# Altium schematic sheet Quad-Stage-Prototype_V1.0.SchDoc: Quad Stage Prototype
size A4; PageSetup: Record=PageOptions|CenterHorizontal=True|CenterVertical=True|PrintScale=0.97|XCorrection=1.00|YCorrection=1.00|PrintKind=0|BorderSize=5000000|LeftOffset=0|BottomOffset=0|Orientation=2|PaperLength=1000|PaperWidth=1000|Scale=100|PaperSource=7|PrintQuality=-3|MediaType=1|DitherType=10|PrintScaleMode=1|PaperKind=A4|PaperIndex=9; Organization: Ostschweizer Fachhochschule; Address2: Florian Baumgartner & Thierry Schwaller; Address3: florian.baumgartner@ost.ch; DocumentNumber: 1; Revision: V1.0; SheetNumber: 1; SheetTotal: 5; Author: Florian Baumgartner & Thierry Schwaller; Subtitle: Overview
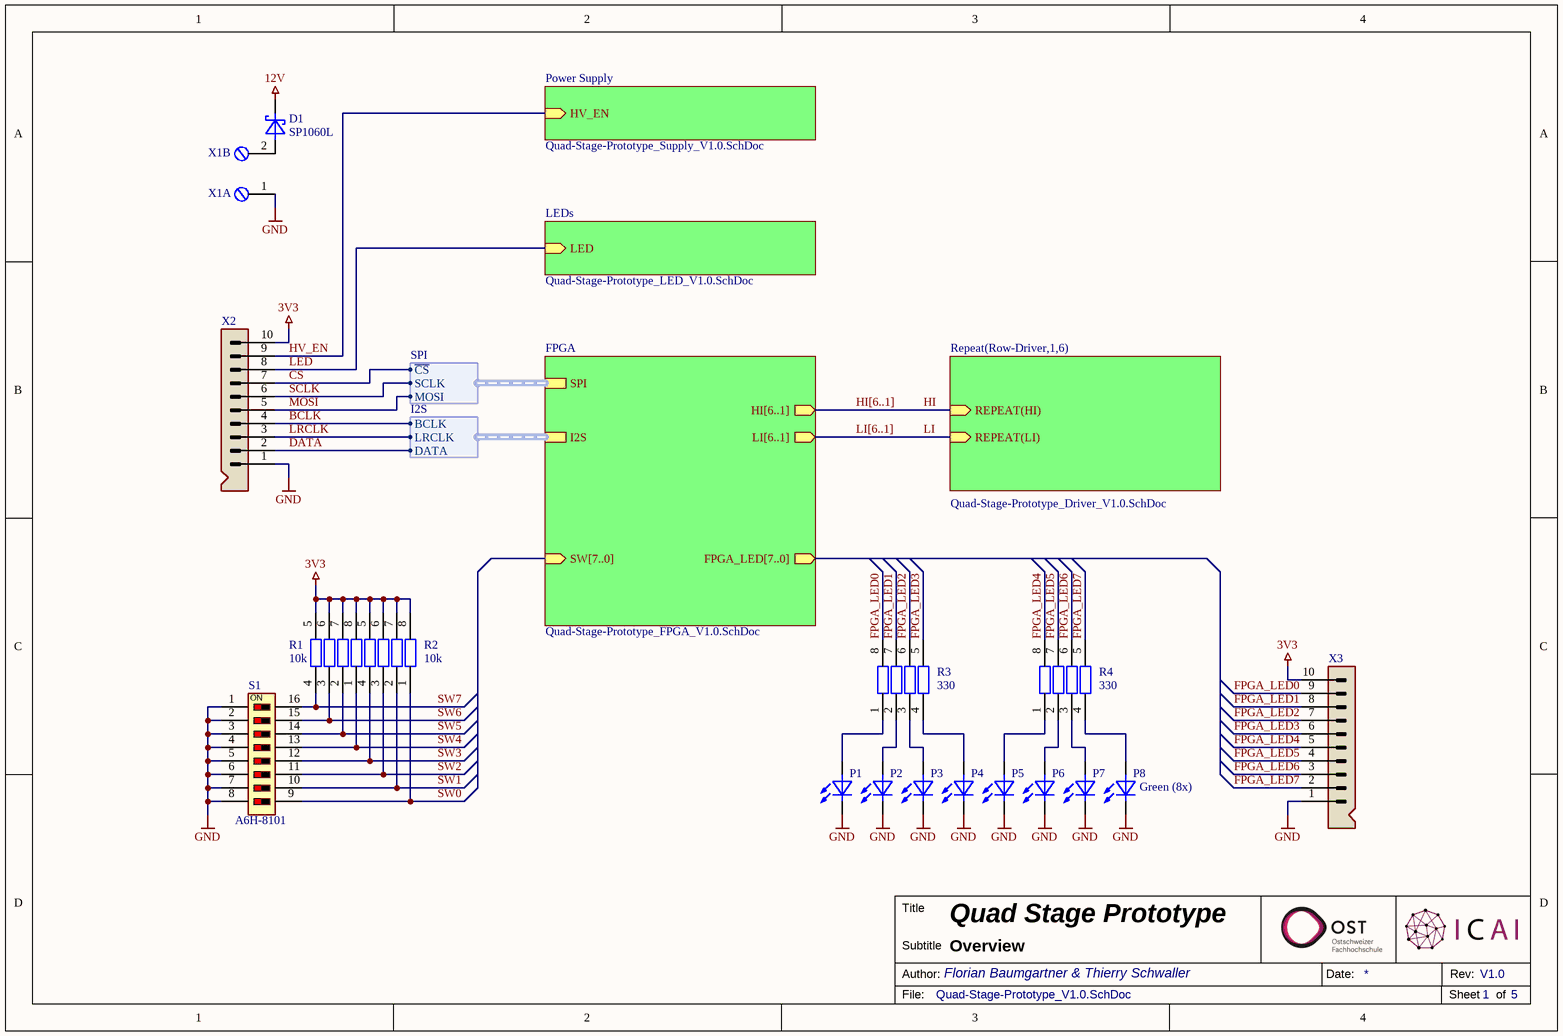
[diagram p0: Quad-Stage-Prototype_V1.0.SchDoc]

## Parts
D1  SP1060L  [SMD Diode TO-277]
P1  Green  [SMD LED 0603]  (value not drawn)
P2  Green  [SMD LED 0603]  (value not drawn)
P3  Green  [SMD LED 0603]  (value not drawn)
P4  Green  [SMD LED 0603]  (value not drawn)
P5  Green  [SMD LED 0603]  (value not drawn)
P6  Green  [SMD LED 0603]  (value not drawn)
P7  Green  [SMD LED 0603]  (value not drawn)
P8  Green  [SMD LED 0603]  (value not drawn)
R1  10k  [SMD Widerstand Array 4-Fach 0603]
R2  10k  [SMD Widerstand Array 4-Fach 0603]
R3  330  [SMD Widerstand Array 4-Fach 0603]
R4  330  [SMD Widerstand Array 4-Fach 0603]
S1  A6H-8101  [SMD DIP-Switch 8-Pos]
X1  X-Klemme (2-Pol)  [THT Schraubklemme 2-Pol (WJ500V-5.08-2P)]  (value not drawn)  (parts A,B of 2)
X2  Stiftleiste (10-Fach)  [THT Pin-Header 10x1 (90°)]  (value not drawn)
X3  Stiftleiste (10-Fach)  [THT Pin-Header 10x1 (90°)]  (value not drawn)

## Sub-sheets
FPGA = Quad-Stage-Prototype_FPGA_V1.0.SchDoc: LI[6..1] (out), HI[6..1] (out), I2S (harness I2S), SPI (harness SPI), FPGA_LED[7..0] (out), SW[7..0] (in)
LEDs = Quad-Stage-Prototype_LED_V1.0.SchDoc: LED (in)
Power Supply = Quad-Stage-Prototype_Supply_V1.0.SchDoc: HV_EN (in)
Repeat(Row-Driver,1,6) = Quad-Stage-Prototype_Driver_V1.0.SchDoc: REPEAT(HI) (in), REPEAT(LI) (in)

## Harnesses
SPI: SCLK, MOSI, ~{CS}
I2S: BCLK, LRCLK, DATA

## Nets
3V3: R1.5 R1.6 R1.7 R1.8 R2.5 R2.6 R2.7 R2.8 X2.10 X3.10
12V: D1.K
GND: P1.K P2.K P3.K P4.K P5.K P6.K P7.K P8.K S1.1 S1.2 S1.3 S1.4 S1.5 S1.6 S1.7 S1.8 X1.1 X2.1 X3.1
BCLK: X2.4 ; sheet FPGA/I2S.BCLK
~{CS}: X2.7 ; sheet FPGA/SPI.~{CS}
DATA: X2.2 ; sheet FPGA/I2S.DATA
FPGA_LED0: R3.8 X3.9
FPGA_LED1: R3.7 X3.8
FPGA_LED2: R3.6 X3.7
FPGA_LED3: R3.5 X3.6
FPGA_LED4: R4.8 X3.5
FPGA_LED5: R4.7 X3.4
FPGA_LED6: R4.6 X3.3
FPGA_LED7: R4.5 X3.2
HI: sheet Repeat(Row-Driver,1,6)/REPEAT(HI)
HV_EN: X2.9 ; sheet Power Supply/HV_EN
LED: X2.8 ; sheet LEDs/LED
LI: sheet Repeat(Row-Driver,1,6)/REPEAT(LI)
LRCLK: X2.3 ; sheet FPGA/I2S.LRCLK
MOSI: X2.5 ; sheet FPGA/SPI.MOSI
SCLK: X2.6 ; sheet FPGA/SPI.SCLK
SW0: R2.1 S1.9
SW1: R2.2 S1.10
SW2: R2.3 S1.11
SW3: R2.4 S1.12
SW4: R1.1 S1.13
SW5: R1.2 S1.14
SW6: R1.3 S1.15
SW7: R1.4 S1.16
NetD1_A: D1.A X1.2
NetP1_A: P1.A R3.1
NetP2_A: P2.A R3.2
NetP3_A: P3.A R3.3
NetP4_A: P4.A R3.4
NetP5_A: P5.A R4.1
NetP6_A: P6.A R4.2
NetP7_A: P7.A R4.3
NetP8_A: P8.A R4.4

## Buses and harness runs
bus HI[6..1] = sheet FPGA/HI[6..1]
bus LI[6..1] = sheet FPGA/LI[6..1]

## Notes on the sheet
- (near P8) Green (8x)
- Title
- Author:
- Subtitle
- Date:
- Rev:
- File:
- Sheet
- of
- (in symbol S-A6H-8101) ON

## Library data of the parts
D1 = R-DIODE:SCHKY: S-DIODE; Component Description: Low Voltage Schottky-Diode; JLC-Parts: C2693399; ComponentLink1Description: Datasheet; ComponentLink1URL: https://datasheet.lcsc.com/lcsc/2103051837_Changjiang-Electronics-Tech--CJ-SP1060L_C2693399.pdf; Component Value: SP1060L; Unit Price: 0.32
P1-P8 = LED Green 0603: General Purpose LED; Component Value: Green (5mA, 2.4V); Digikey: 350-2035-1-ND; Farnell: 1465991; Mouser: 645-598-8070-107F; Unit Price: 0.34; ComponentLink1Description: Datasheet; ComponentLink1URL: https://datasheet.lcsc.com/szlcsc/Everlight-Elec-19-217-GHC-YR1S2-3T_C72043.pdf; JLC-Parts: C72043; Component Description: General Purpose LED
R1 R2 = R-Array Single Quad E24 - 10k: Isolated Resistor Array; Component Value: 10k (4x, 50V, 62.5mW, 5%); ComponentLink1Description: Datasheet; ComponentLink1URL: https://datasheet.lcsc.com/lcsc/1810191515_UNI-ROYAL-Uniroyal-Elec-4D03WGJ0103T5E_C29718.pdf; Digikey: Y4103CT-ND; Farnell: 2060167; JLC-Parts: C29718; Mouser: 667-EXB-V8V103JV; Unit Price: 0.01; Component Description: Isolated Resistor Array
R3 R4 = R-Array Single Quad E24 - 330: Isolated Resistor Array; Component Value: 330 (4x, 50V, 62.5mW, 5%); ComponentLink1Description: Datasheet; ComponentLink1URL: https://datasheet.lcsc.com/lcsc/1810170717_UNI-ROYAL-Uniroyal-Elec-4D03WGJ0331T5E_C12018.pdf; Digikey: Y4331CT-ND; Farnell: 2060160; JLC-Parts: C12018; Mouser: 667-EXB-V8V331JV; Unit Price: 0.01; Component Description: Isolated Resistor Array
S1 = S-A6H-8101: DIP-Switch 8 Positions; Digikey: SW1118-ND; Farnell: 8774277; Mouser: 653-A6H-8101; JLC-Parts: C89711; Component Description: DIP-Switch 8 Positions; Component Value: A6H-8101; Unit Price: 2.92
X1 = X-Klemme (2-Pol): Component Description: Screw Terminal; Component Value: WJ500V-5.08-2P (2-Pol, 250V, 8A, 5.08mm); ComponentLink1Description: Datasheet; ComponentLink1URL: https://datasheet.lcsc.com/lcsc/1912251636_Ningbo-Kangnex-Elec-WJ500V-5-08-2P_C8465.pdf; JLC-Parts: C8465; Unit Price: 0.08
X2 X3 = X-Stiftleiste (10-Fach): Component Description: Pin Header; Component Value: 10-Pol; Digikey: 952-2250-ND; Farnell: 3756366; Mouser: 855-M20-9961045; Unit Price: 0.55